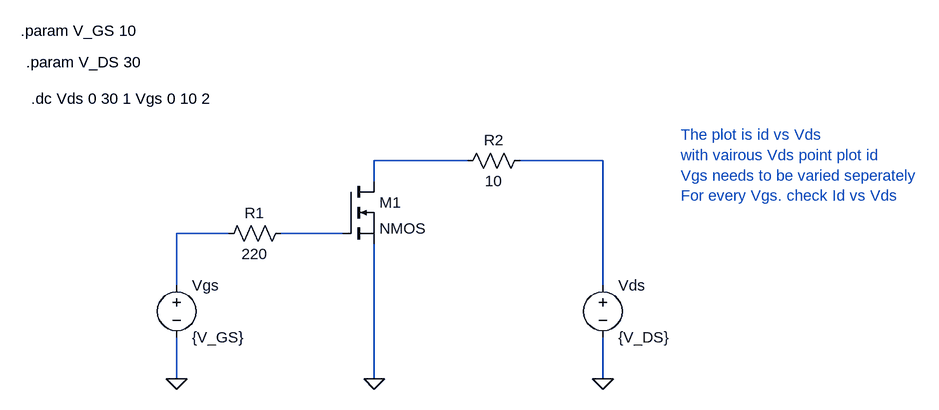
[diagram p0: schematic MOSFET_OP_CHARECTERISTICS.asc]
MOSFET_OP_CHARECTERISTICS.asc, the LTspice schematic file:
Version 4.1
SHEET 1 1056 680
WIRE 336 48 192 48
WIRE 544 48 416 48
WIRE 192 80 192 48
WIRE -32 160 -112 160
WIRE 144 160 48 160
WIRE -112 240 -112 160
WIRE 544 240 544 48
WIRE -112 384 -112 320
WIRE 192 384 192 176
WIRE 544 384 544 320
FLAG -112 384 0
FLAG 544 384 0
FLAG 192 384 0
SYMBOL nmos 144 80 R0
SYMATTR InstName M1
SYMBOL res 64 144 R90
WINDOW 0 0 56 VBottom 2
WINDOW 3 32 56 VTop 2
SYMATTR InstName R1
SYMATTR Value 220
SYMBOL res 432 32 R90
WINDOW 0 0 56 VBottom 2
WINDOW 3 32 56 VTop 2
SYMATTR InstName R2
SYMATTR Value 10
SYMBOL voltage -112 224 R0
SYMATTR InstName Vgs
SYMATTR Value {V_GS}
SYMBOL voltage 544 224 R0
SYMATTR InstName Vds
SYMATTR Value {V_DS}
TEXT -352 -152 Left 2 !.param V_GS 10
TEXT -344 -104 Left 2 !.param V_DS 30
TEXT -336 -48 Left 2 !.dc Vds 0 30 1 Vgs 0 10 2
TEXT 664 8 Left 2 ;The plot is id vs Vds\nwith vairous Vds point plot id\nVgs needs to be varied seperately\nFor every Vgs. check Id vs Vds

The netlist it stands for:
* MOSFET_OP_CHARECTERISTICS.asc
M1 N001 N004 0 0 NMOS
R1 N004 N003 220
R2 N002 N001 10
Vgs N003 0 {V_GS}
Vds N002 0 {V_DS}
.model NMOS NMOS
.model PMOS PMOS
.lib standard.mos
.param V_GS 10
.param V_DS 30
.dc Vds 0 30 1 Vgs 0 10 2
* The plot is id vs Vds
* with vairous Vds point plot id
* Vgs needs to be varied seperately
* For every Vgs. check Id vs Vds
.backanno
.end